# Altium schematic sheet 5_OB-Connectors.SchDoc
size A; SheetNumber: 6; SheetTotal: 6
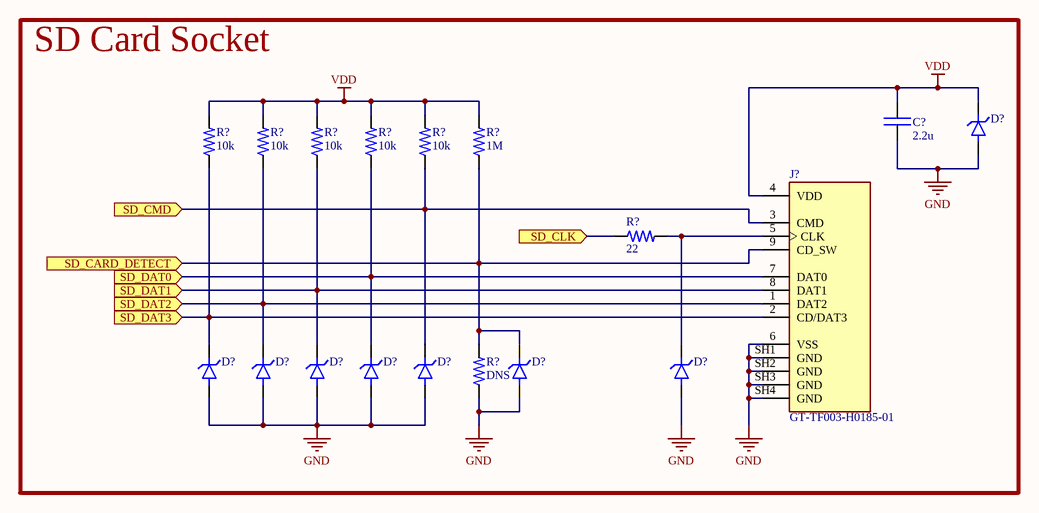
[diagram p0: 5_OB-Connectors.SchDoc]

## Parts
(Parts that share a designator on the sheet are numbered #1, #2 ... from top to bottom, then left to right.)
C?  value 2.2u  [0402C]  (hidden comment: CAP)
D?#1  RCLAMP0521P.TCT  [RCLAMP0521P.TCT]  (value not drawn)
D?#2  RCLAMP0521P.TCT  [RCLAMP0521P.TCT]  (value not drawn)
D?#3  RCLAMP0521P.TCT  [RCLAMP0521P.TCT]  (value not drawn)
D?#4  RCLAMP0521P.TCT  [RCLAMP0521P.TCT]  (value not drawn)
D?#5  RCLAMP0521P.TCT  [RCLAMP0521P.TCT]  (value not drawn)
D?#6  RCLAMP0521P.TCT  [RCLAMP0521P.TCT]  (value not drawn)
D?#7  RCLAMP0521P.TCT  [RCLAMP0521P.TCT]  (value not drawn)
D?#8  RCLAMP0521P.TCT  [RCLAMP0521P.TCT]  (value not drawn)
J?  GT-TF003-H0185-01  [GTTF003H018501]
R?#1  value 10k  [0402R]  (hidden comment: RES)
R?#2  value 10k  [0402R]  (hidden comment: RES)
R?#3  value 10k  [0402R]  (hidden comment: RES)
R?#4  value 10k  [0402R]  (hidden comment: RES)
R?#5  value 10k  [0402R]  (hidden comment: RES)
R?#6  value 1M  [0402R]  (hidden comment: RES)
R?#7  value 22  [0402R]  (hidden comment: RES)
R?#8  value DNS  [0402R]  (hidden comment: RES)

## Blocks framed on the sheet
SD Card Socket: C? D?#1-D?#8 J? R?#1-R?#8

## Ports
SD_CARD_DETECT (in), SD_CLK (in), SD_CMD (in), SD_DAT0 (in), SD_DAT1 (in), SD_DAT2 (in), SD_DAT3 (in)

## Nets
GND: C?.1 D?#1.A D?#2.A D?#3.A D?#4.A D?#5.A D?#6.A D?#7.A D?#8.A J?.6(VSS) J?.SH1(GND) J?.SH2(GND) J?.SH3(GND) J?.SH4(GND) R?#8.1
VDD: C?.2 D?#1.K J?.4(VDD) R?#1.2 R?#2.2 R?#3.2 R?#4.2 R?#5.2 R?#6.2
SD_CARD_DETECT: D?#7.K J?.9(CD_SW) R?#6.1 R?#8.2 ; port SD_CARD_DETECT
SD_CLK: R?#7.1 ; port SD_CLK
SD_CMD: D?#6.K J?.3(CMD) R?#5.1 ; port SD_CMD
SD_DAT0: D?#5.K J?.7(DAT0) R?#4.1 ; port SD_DAT0
SD_DAT1: D?#4.K J?.8(DAT1) R?#3.1 ; port SD_DAT1
SD_DAT2: D?#3.K J?.1(DAT2) R?#2.1 ; port SD_DAT2
SD_DAT3: D?#2.K J?.2(CD/DAT3) R?#1.1 ; port SD_DAT3
NetD?#8_K: D?#8.K J?.5(CLK) R?#7.2

## Library data of the parts
C? = CAP: Capacitor; MFR: *; MFR PN: *; JLCPCB PN: *; Footprint: *
D?#1-D?#8 = TVS DIODE: 25V Clamp 4A (8/20µs) Ipp Tvs Diode Surface Mount SLP1006P2; MFR: Semtech Corporation; Type: SMD; MFR PN: RCLAMP0521P.TCT; Value: RCLAMP0521P.TCT
J? = SD-CONN-SMD_JLC: MFR: G-Switch; MFR PN: GT-TF003-H0185-01; Type: SMD; Value: GT-TF003-H0185-01
R?#1-R?#8 = RES: Resistor; MFR PN: *; MFR: *; JLCPCB PN: *